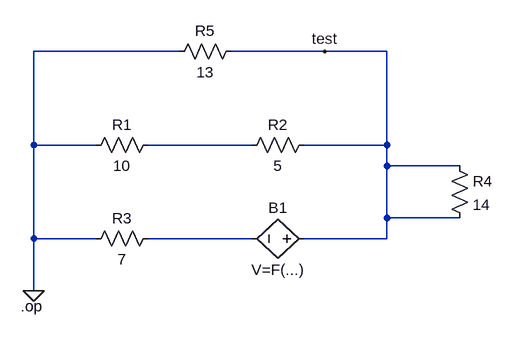
[diagram p0: schematic LTSpice_primer_001.asc]
LTSpice_primer_001.asc, the LTspice schematic file:
Version 4
SHEET 1 880 680
WIRE 112 -112 -112 -112
WIRE 336 -112 192 -112
WIRE 432 -112 336 -112
WIRE -112 32 -112 -112
WIRE -16 32 -112 32
WIRE 224 32 64 32
WIRE 432 32 432 -112
WIRE 432 32 304 32
WIRE 432 64 432 32
WIRE 544 64 432 64
WIRE 432 144 432 64
WIRE 544 144 432 144
WIRE -112 176 -112 32
WIRE -16 176 -112 176
WIRE 224 176 64 176
WIRE 432 176 432 144
WIRE 432 176 304 176
WIRE -112 256 -112 176
FLAG -112 256 0
FLAG 336 -112 test
SYMBOL res 80 16 R90
WINDOW 0 0 56 VBottom 2
WINDOW 3 32 56 VTop 2
SYMATTR InstName R1
SYMATTR Value 10
SYMATTR SpiceLine tol=1 pwr=0.1
SYMBOL res 320 16 R90
WINDOW 0 0 56 VBottom 2
WINDOW 3 32 56 VTop 2
SYMATTR InstName R2
SYMATTR Value 5
SYMATTR SpiceLine tol=1 pwr=5
SYMBOL res 80 160 R90
WINDOW 0 0 56 VBottom 2
WINDOW 3 32 56 VTop 2
SYMATTR InstName R3
SYMATTR Value 7
SYMBOL bv 320 176 R90
WINDOW 0 -32 56 VBottom 2
WINDOW 3 32 56 VTop 2
SYMATTR InstName B1
SYMBOL res 528 48 R0
SYMATTR InstName R4
SYMATTR Value 14
SYMBOL res 208 -128 R90
WINDOW 0 0 56 VBottom 2
WINDOW 3 32 56 VTop 2
SYMATTR InstName R5
SYMATTR Value 13
TEXT -132 280 Left 2 !.op

The netlist it stands for:
* LTSpice_primer_001.asc
R1 N001 0 10 tol=1 pwr=0.1
R2 test N001 5 tol=1 pwr=5
R3 N002 0 7
B1 test N002 V=F(...)
R4 test test 14
R5 test 0 13
.op
.backanno
.end